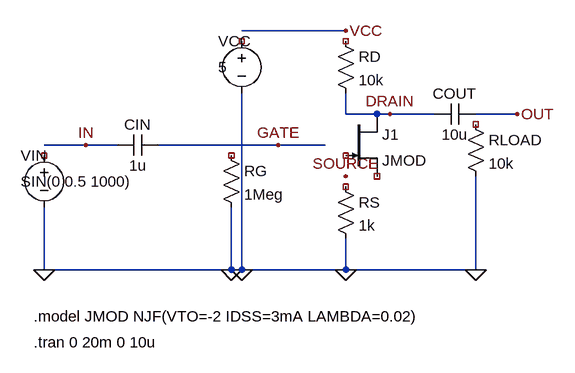
[diagram p0: schematic jfet_saturator.asc]
jfet_saturator.asc, the LTspice schematic file:
Version 4
SHEET 1 1192 760
WIRE 96 96 208 96
WIRE 272 96 384 96
WIRE 384 96 528 96
WIRE 560 16 560 48
WIRE 560 48 696 48
WIRE 400 -80 560 -80
WIRE 96 192 96 288
WIRE 384 192 384 288
WIRE 560 240 560 288
WIRE 760 144 760 288
WIRE 400 16 400 288
WIRE 96 288 760 288
WIRE 760 48 824 48
FLAG 96 288 0
FLAG 384 288 0
FLAG 560 288 0
FLAG 760 288 0
FLAG 400 288 0
FLAG 160 96 IN
FLAG 456 96 GATE
FLAG 628 48 DRAIN
FLAG 560 -80 VCC
FLAG 824 48 OUT
FLAG 560 144 SOURCE
SYMBOL voltage 96 96 R0
WINDOW 123 0 0 Left 0
WINDOW 39 0 0 Left 0
WINDOW 0 -36 16 Left 2
WINDOW 3 -36 56 Left 2
SYMATTR InstName VIN
SYMATTR Value SIN(0 0.5 1000)
SYMBOL cap 272 80 R90
WINDOW 0 0 32 VBottom 2
WINDOW 3 32 32 VTop 2
SYMATTR InstName CIN
SYMATTR Value 1u
SYMBOL res 368 96 R0
SYMATTR InstName RG
SYMATTR Value 1Meg
SYMBOL res 544 -80 R0
SYMATTR InstName RD
SYMATTR Value 10k
SYMBOL res 544 144 R0
SYMATTR InstName RS
SYMATTR Value 1k
SYMBOL njf 560 48 R0
SYMATTR InstName J1
SYMATTR Value JMOD
SYMBOL cap 760 32 R90
WINDOW 0 0 32 VBottom 2
WINDOW 3 32 32 VTop 2
SYMATTR InstName COUT
SYMATTR Value 10u
SYMBOL res 744 48 R0
SYMATTR InstName RLOAD
SYMATTR Value 10k
SYMBOL voltage 400 -80 R0
WINDOW 123 0 0 Left 0
WINDOW 39 0 0 Left 0
WINDOW 0 -36 16 Left 2
WINDOW 3 -36 56 Left 2
SYMATTR InstName VCC
SYMATTR Value 5
TEXT 80 360 Left 2 !.model JMOD NJF(VTO=-2 IDSS=3mA LAMBDA=0.02)
TEXT 80 400 Left 2 !.tran 0 20m 0 10u

The netlist it stands for:
* jfet_saturator.asc
VIN NC_01 0 SIN(0 0.5 1000)
CIN GATE IN 1u
RG NC_02 0 1Meg
RD NC_03 DRAIN 10k
RS NC_04 0 1k
* J1: JMOD (symbol njf not certain, pin order unknown); nets seen at it: DRAIN
COUT OUT DRAIN 10u
RLOAD NC_07 0 10k
VCC NC_08 0 5
.model JMOD NJF(VTO=-2 IDSS=3mA LAMBDA=0.02)
.tran 0 20m 0 10u
.backanno
.end